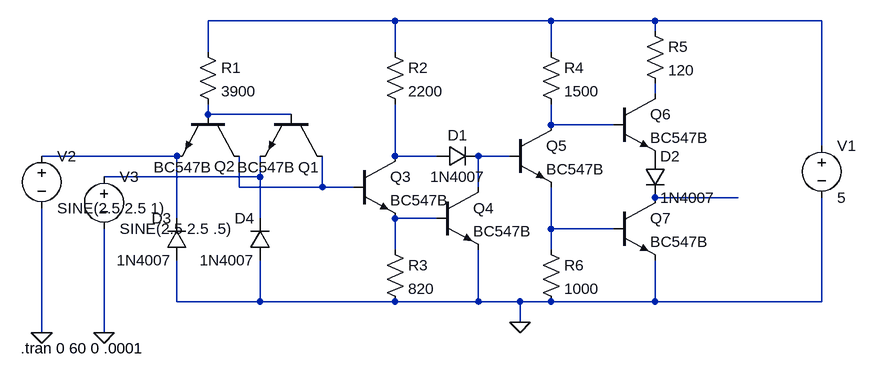
[diagram p0: schematic SN5408-MP.asc]
SN5408-MP.asc, the LTspice schematic file:
Version 4
SHEET 1 1080 680
WIRE 368 -16 80 -16
WIRE 608 -16 368 -16
WIRE 768 -16 608 -16
WIRE 1024 -16 768 -16
WIRE 768 0 768 -16
WIRE 80 32 80 -16
WIRE 368 32 368 -16
WIRE 608 32 608 -16
WIRE 768 96 768 80
WIRE 80 128 80 112
WIRE 208 128 80 128
WIRE 608 144 608 112
WIRE 704 144 608 144
WIRE 1024 176 1024 -16
WIRE 32 192 -176 192
WIRE 368 192 368 112
WIRE 432 192 368 192
WIRE 544 192 496 192
WIRE 160 224 160 192
WIRE 160 224 -80 224
WIRE 128 240 128 192
WIRE 256 240 256 192
WIRE 256 240 128 240
WIRE 304 240 256 240
WIRE 496 240 496 192
WIRE 896 256 768 256
WIRE 32 288 32 192
WIRE 160 288 160 224
WIRE 432 288 368 288
WIRE 608 304 608 240
WIRE 704 304 608 304
WIRE 368 336 368 288
WIRE 608 336 608 304
WIRE 32 416 32 352
WIRE 160 416 160 352
WIRE 160 416 32 416
WIRE 368 416 160 416
WIRE 496 416 496 336
WIRE 496 416 368 416
WIRE 560 416 496 416
WIRE 608 416 560 416
WIRE 768 416 768 352
WIRE 768 416 608 416
WIRE 1024 416 1024 256
WIRE 1024 416 768 416
WIRE 560 448 560 416
WIRE -176 464 -176 272
WIRE -80 464 -80 304
FLAG 560 448 0
FLAG -176 464 0
FLAG -80 464 0
SYMBOL npn 256 128 R90
WINDOW 0 81 5 VRight 2
WINDOW 3 81 42 VRight 2
SYMATTR InstName Q1
SYMATTR Value BC547B
SYMBOL npn 128 128 R90
WINDOW 0 80 6 VRight 2
WINDOW 3 81 42 VRight 2
SYMATTR InstName Q2
SYMATTR Value BC547B
SYMBOL npn 304 192 R0
SYMATTR InstName Q3
SYMATTR Value BC547B
SYMBOL npn 432 240 R0
SYMATTR InstName Q4
SYMATTR Value BC547B
SYMBOL res 352 320 R0
SYMATTR InstName R3
SYMATTR Value 820
SYMATTR SpiceLine tol=5
SYMBOL diode 432 208 R270
WINDOW 0 32 32 VTop 2
WINDOW 3 0 32 VBottom 2
SYMATTR InstName D1
SYMATTR Value 1N4007
SYMBOL npn 544 144 R0
SYMATTR InstName Q5
SYMATTR Value BC547B
SYMBOL res 592 16 R0
SYMATTR InstName R4
SYMATTR Value 1500
SYMATTR SpiceLine tol=5
SYMBOL npn 704 96 R0
SYMATTR InstName Q6
SYMATTR Value BC547B
SYMBOL npn 704 256 R0
SYMATTR InstName Q7
SYMATTR Value BC547B
SYMBOL res 592 320 R0
SYMATTR InstName R6
SYMATTR Value 1000
SYMBOL diode 752 192 R0
SYMATTR InstName D2
SYMATTR Value 1N4007
SYMBOL diode 48 352 R180
WINDOW 0 24 64 Left 2
WINDOW 3 24 0 Left 2
SYMATTR InstName D3
SYMATTR Value 1N4007
SYMBOL diode 176 352 R180
WINDOW 0 24 64 Left 2
WINDOW 3 24 0 Left 2
SYMATTR InstName D4
SYMATTR Value 1N4007
SYMBOL voltage 1024 160 R0
WINDOW 123 0 0 Left 0
WINDOW 39 0 0 Left 0
SYMATTR InstName V1
SYMATTR Value 5
SYMBOL voltage -176 176 R0
WINDOW 123 0 0 Left 0
WINDOW 39 0 0 Left 0
SYMATTR InstName V2
SYMATTR Value SINE(2.5 2.5 1)
SYMBOL voltage -80 208 R0
WINDOW 123 0 0 Left 0
SYMATTR InstName V3
SYMATTR Value SINE(2.5 2.5 .5)
SYMBOL res 64 16 R0
SYMATTR InstName R1
SYMATTR Value 3900
SYMATTR SpiceLine tol=5
SYMBOL res 352 16 R0
SYMATTR InstName R2
SYMATTR Value 2200
SYMATTR SpiceLine tol=5
SYMBOL res 752 -16 R0
SYMATTR InstName R5
SYMATTR Value 120
SYMATTR SpiceLine tol=5 pwr=0.1
TEXT -208 488 Left 2 !.tran 0 60 0 .0001

The netlist it stands for:
* SN5408-MP.asc
Q1 N009 N003 N008 0 BC547B
Q2 N009 N003 N005 0 BC547B
Q3 N006 N009 N011 0 BC547B
Q4 N007 N011 0 0 BC547B
R3 N011 0 820 tol=5
D1 N006 N007 1N4007
Q5 N004 N007 N012 0 BC547B
R4 N001 N004 1500 tol=5
Q6 N002 N004 P001 0 BC547B
Q7 N010 N012 0 0 BC547B
R6 N012 0 1000
D2 P001 N010 1N4007
D3 0 N005 1N4007
D4 0 N008 1N4007
V1 N001 0 5
V2 N005 0 SINE(2.5 2.5 1)
V3 N008 0 SINE(2.5 2.5 .5)
R1 N001 N003 3900 tol=5
R2 N001 N006 2200 tol=5
R5 N001 N002 120 tol=5 pwr=0.1
.model D D
.lib standard.dio
.model NPN NPN
.model PNP PNP
.lib standard.bjt
.tran 0 60 0 .0001
.backanno
.end